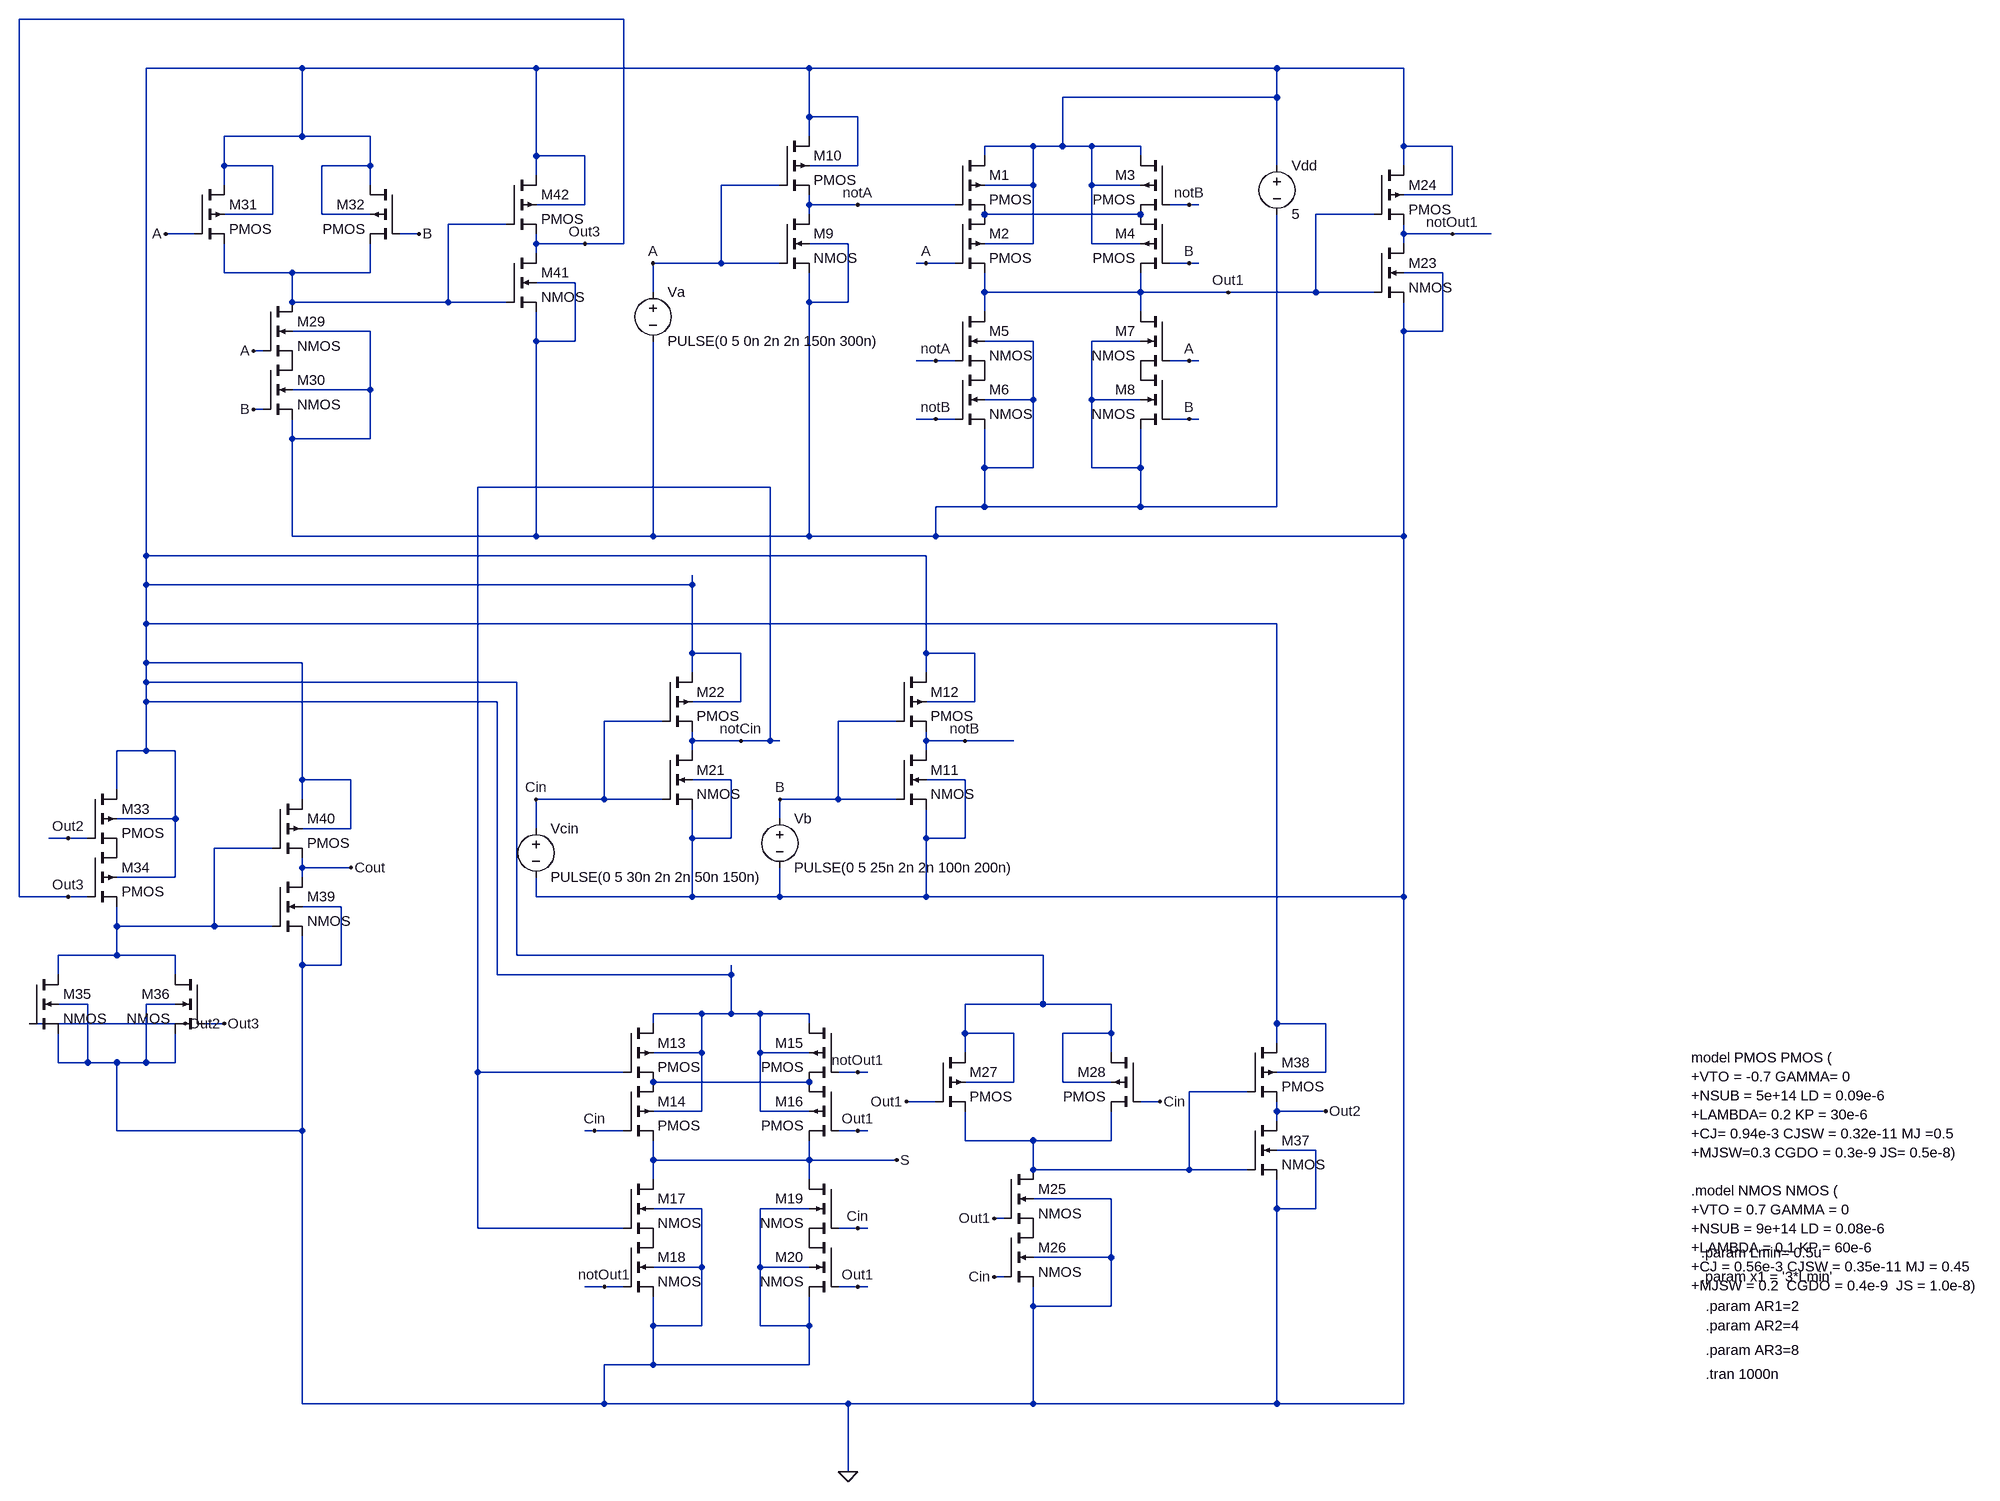
[diagram p0: schematic Full Adder.asc]
Full Adder.asc, the LTspice schematic file:
Version 4
SHEET 1 3220 2340
WIRE -560 -384 -1552 -384
WIRE -1088 -304 -1344 -304
WIRE -704 -304 -1088 -304
WIRE -256 -304 -704 -304
WIRE 512 -304 -256 -304
WIRE 720 -304 512 -304
WIRE 512 -256 512 -304
WIRE 512 -256 160 -256
WIRE -256 -224 -256 -304
WIRE -176 -224 -256 -224
WIRE -1088 -192 -1088 -304
WIRE -1088 -192 -1216 -192
WIRE -976 -192 -1088 -192
WIRE -256 -192 -256 -224
WIRE 112 -176 32 -176
WIRE 160 -176 160 -256
WIRE 160 -176 112 -176
WIRE 208 -176 160 -176
WIRE 288 -176 208 -176
WIRE 720 -176 720 -304
WIRE 800 -176 720 -176
WIRE -704 -160 -704 -304
WIRE -624 -160 -704 -160
WIRE 32 -160 32 -176
WIRE 288 -160 288 -176
WIRE -1216 -144 -1216 -192
WIRE -1136 -144 -1216 -144
WIRE -976 -144 -976 -192
WIRE -976 -144 -1056 -144
WIRE -176 -144 -176 -224
WIRE -176 -144 -256 -144
WIRE 512 -144 512 -256
WIRE 720 -144 720 -176
WIRE -704 -128 -704 -160
WIRE -1216 -112 -1216 -144
WIRE -976 -112 -976 -144
WIRE -304 -112 -400 -112
WIRE 112 -112 112 -176
WIRE 112 -112 32 -112
WIRE 208 -112 208 -176
WIRE 288 -112 208 -112
WIRE 800 -96 800 -176
WIRE 800 -96 720 -96
WIRE -624 -80 -624 -160
WIRE -624 -80 -704 -80
WIRE -256 -80 -256 -96
WIRE -176 -80 -256 -80
WIRE -16 -80 -176 -80
WIRE 368 -80 336 -80
WIRE 384 -80 368 -80
WIRE -1136 -64 -1136 -144
WIRE -1136 -64 -1216 -64
WIRE -1056 -64 -1056 -144
WIRE -976 -64 -1056 -64
WIRE -256 -64 -256 -80
WIRE 288 -64 32 -64
WIRE 672 -64 576 -64
WIRE -752 -48 -848 -48
WIRE -1264 -32 -1312 -32
WIRE -896 -32 -928 -32
WIRE 720 -32 720 -48
WIRE 800 -32 720 -32
WIRE 864 -32 800 -32
WIRE -704 -16 -704 -32
WIRE -624 -16 -704 -16
WIRE -560 -16 -560 -384
WIRE -560 -16 -624 -16
WIRE -192 -16 -256 -16
WIRE 112 -16 112 -112
WIRE 112 -16 32 -16
WIRE 208 -16 208 -112
WIRE 288 -16 208 -16
WIRE 720 -16 720 -32
WIRE -704 0 -704 -16
WIRE -400 16 -400 -112
WIRE -400 16 -512 16
WIRE -304 16 -400 16
WIRE -64 16 -80 16
WIRE -16 16 -64 16
WIRE 368 16 336 16
WIRE 384 16 368 16
WIRE -1216 32 -1216 -16
WIRE -1104 32 -1216 32
WIRE -976 32 -976 -16
WIRE -976 32 -1104 32
WIRE 784 32 720 32
WIRE -640 48 -704 48
WIRE -512 64 -512 16
WIRE 32 64 32 32
WIRE 288 64 288 32
WIRE 288 64 32 64
WIRE 432 64 288 64
WIRE 576 64 576 -64
WIRE 576 64 432 64
WIRE 672 64 576 64
WIRE -1104 80 -1104 32
WIRE -848 80 -848 -48
WIRE -848 80 -1104 80
WIRE -752 80 -848 80
WIRE -256 80 -256 32
WIRE -192 80 -192 -16
WIRE -192 80 -256 80
WIRE 32 96 32 64
WIRE 288 96 288 64
WIRE -976 128 -1104 128
WIRE 720 128 720 80
WIRE 784 128 784 32
WIRE 784 128 720 128
WIRE -704 144 -704 96
WIRE -640 144 -640 48
WIRE -640 144 -704 144
WIRE 112 144 32 144
WIRE 288 144 208 144
WIRE -1152 160 -1168 160
WIRE -48 176 -80 176
WIRE -16 176 -48 176
WIRE 368 176 336 176
WIRE 384 176 368 176
WIRE -976 224 -976 128
WIRE -976 224 -1104 224
WIRE 112 240 112 144
WIRE 112 240 32 240
WIRE 208 240 208 144
WIRE 288 240 208 240
WIRE -1152 256 -1168 256
WIRE -48 272 -80 272
WIRE -16 272 -48 272
WIRE 368 272 336 272
WIRE 384 272 368 272
WIRE -1104 304 -1104 272
WIRE -976 304 -976 224
WIRE -976 304 -1104 304
WIRE 32 352 32 288
WIRE 112 352 112 240
WIRE 112 352 32 352
WIRE 208 352 208 240
WIRE 288 352 288 288
WIRE 288 352 208 352
WIRE -320 384 -800 384
WIRE 32 416 32 352
WIRE 32 416 -48 416
WIRE 288 416 288 352
WIRE 288 416 32 416
WIRE 512 416 512 -64
WIRE 512 416 288 416
WIRE -1104 464 -1104 304
WIRE -704 464 -704 144
WIRE -704 464 -1104 464
WIRE -512 464 -512 144
WIRE -512 464 -704 464
WIRE -256 464 -256 80
WIRE -256 464 -512 464
WIRE -48 464 -48 416
WIRE -48 464 -256 464
WIRE 720 464 720 128
WIRE 720 464 -48 464
WIRE -1344 496 -1344 -304
WIRE -64 496 -1344 496
WIRE -1344 544 -1344 496
WIRE -448 544 -448 528
WIRE -448 544 -1344 544
WIRE -1344 608 -1344 544
WIRE 512 608 -1344 608
WIRE -448 656 -448 544
WIRE -368 656 -448 656
WIRE -64 656 -64 496
WIRE 16 656 -64 656
WIRE -1344 672 -1344 608
WIRE -1088 672 -1344 672
WIRE -448 688 -448 656
WIRE -64 688 -64 656
WIRE -1344 704 -1344 672
WIRE -736 704 -1344 704
WIRE -1344 736 -1344 704
WIRE -768 736 -1344 736
WIRE -368 736 -368 656
WIRE -368 736 -448 736
WIRE 16 736 16 656
WIRE 16 736 -64 736
WIRE -496 768 -592 768
WIRE -112 768 -208 768
WIRE -448 800 -448 784
WIRE -368 800 -448 800
WIRE -320 800 -320 384
WIRE -320 800 -368 800
WIRE -304 800 -320 800
WIRE -64 800 -64 784
WIRE 0 800 -64 800
WIRE 80 800 0 800
WIRE -1344 816 -1344 736
WIRE -1344 816 -1392 816
WIRE -1296 816 -1344 816
WIRE -448 816 -448 800
WIRE -64 816 -64 800
WIRE -1088 864 -1088 672
WIRE -1008 864 -1088 864
WIRE -384 864 -448 864
WIRE 0 864 -64 864
WIRE -1392 880 -1392 816
WIRE -1088 896 -1088 864
WIRE -592 896 -592 768
WIRE -592 896 -704 896
WIRE -496 896 -592 896
WIRE -208 896 -208 768
WIRE -208 896 -304 896
WIRE -112 896 -208 896
WIRE -1296 928 -1296 816
WIRE -1296 928 -1392 928
WIRE -304 928 -304 896
WIRE -1008 944 -1008 864
WIRE -1008 944 -1088 944
WIRE -704 944 -704 896
WIRE -1472 960 -1504 960
WIRE -1440 960 -1472 960
WIRE -448 960 -448 912
WIRE -384 960 -384 864
WIRE -384 960 -448 960
WIRE -64 960 -64 912
WIRE 0 960 0 864
WIRE 0 960 -64 960
WIRE -1136 976 -1232 976
WIRE -1088 1008 -1088 992
WIRE -1008 1008 -1088 1008
WIRE -1296 1024 -1296 928
WIRE -1296 1024 -1392 1024
WIRE -1088 1024 -1088 1008
WIRE -1552 1056 -1552 -384
WIRE -1472 1056 -1552 1056
WIRE -1440 1056 -1472 1056
WIRE -704 1056 -704 1024
WIRE -448 1056 -448 960
WIRE -448 1056 -704 1056
WIRE -304 1056 -304 1008
WIRE -304 1056 -448 1056
WIRE -64 1056 -64 960
WIRE -64 1056 -304 1056
WIRE 720 1056 720 464
WIRE 720 1056 -64 1056
WIRE -1024 1072 -1088 1072
WIRE -1392 1104 -1392 1072
WIRE -1232 1104 -1232 976
WIRE -1232 1104 -1392 1104
WIRE -1136 1104 -1232 1104
WIRE -1392 1152 -1392 1104
WIRE -1392 1152 -1488 1152
WIRE -1296 1152 -1392 1152
WIRE -736 1152 -736 704
WIRE 128 1152 -736 1152
WIRE -1088 1168 -1088 1120
WIRE -1024 1168 -1024 1072
WIRE -1024 1168 -1088 1168
WIRE -1488 1184 -1488 1152
WIRE -1296 1184 -1296 1152
WIRE -768 1184 -768 736
WIRE -384 1184 -384 1168
WIRE -384 1184 -768 1184
WIRE -1440 1232 -1488 1232
WIRE -1296 1232 -1344 1232
WIRE 128 1232 128 1152
WIRE 128 1232 0 1232
WIRE 240 1232 128 1232
WIRE -432 1248 -512 1248
WIRE -384 1248 -384 1184
WIRE -384 1248 -432 1248
WIRE -336 1248 -384 1248
WIRE -256 1248 -336 1248
WIRE -1280 1264 -1536 1264
WIRE -1216 1264 -1248 1264
WIRE -512 1264 -512 1248
WIRE -256 1264 -256 1248
WIRE 512 1264 512 608
WIRE 592 1264 512 1264
WIRE 0 1280 0 1232
WIRE 80 1280 0 1280
WIRE 240 1280 240 1232
WIRE 240 1280 160 1280
WIRE 512 1296 512 1264
WIRE -432 1312 -432 1248
WIRE -432 1312 -512 1312
WIRE -336 1312 -336 1248
WIRE -256 1312 -336 1312
WIRE 0 1312 0 1280
WIRE 240 1312 240 1280
WIRE -1488 1328 -1488 1280
WIRE -1440 1328 -1440 1232
WIRE -1440 1328 -1488 1328
WIRE -1392 1328 -1440 1328
WIRE -1344 1328 -1344 1232
WIRE -1344 1328 -1392 1328
WIRE -1296 1328 -1296 1280
WIRE -1296 1328 -1344 1328
WIRE -800 1344 -800 384
WIRE -560 1344 -800 1344
WIRE -176 1344 -208 1344
WIRE -160 1344 -176 1344
WIRE 592 1344 592 1264
WIRE 592 1344 512 1344
WIRE -256 1360 -512 1360
WIRE 80 1360 80 1280
WIRE 80 1360 0 1360
WIRE 160 1360 160 1280
WIRE 240 1360 160 1360
WIRE 464 1376 368 1376
WIRE -48 1392 -96 1392
WIRE 320 1392 288 1392
WIRE -432 1408 -432 1312
WIRE -432 1408 -512 1408
WIRE -336 1408 -336 1312
WIRE -256 1408 -336 1408
WIRE 512 1408 512 1392
WIRE 592 1408 512 1408
WIRE 512 1424 512 1408
WIRE -1392 1440 -1392 1328
WIRE -1088 1440 -1088 1168
WIRE -1088 1440 -1392 1440
WIRE -608 1440 -624 1440
WIRE -560 1440 -608 1440
WIRE -176 1440 -208 1440
WIRE -160 1440 -176 1440
WIRE 0 1456 0 1408
WIRE 112 1456 0 1456
WIRE 240 1456 240 1408
WIRE 240 1456 112 1456
WIRE 576 1472 512 1472
WIRE -512 1488 -512 1456
WIRE -256 1488 -256 1456
WIRE -256 1488 -512 1488
WIRE -112 1488 -256 1488
WIRE 112 1504 112 1456
WIRE 368 1504 368 1376
WIRE 368 1504 112 1504
WIRE 464 1504 368 1504
WIRE -512 1520 -512 1488
WIRE -256 1520 -256 1488
WIRE 240 1552 112 1552
WIRE -432 1568 -512 1568
WIRE -256 1568 -336 1568
WIRE 512 1568 512 1520
WIRE 576 1568 576 1472
WIRE 576 1568 512 1568
WIRE 64 1584 48 1584
WIRE -800 1600 -800 1344
WIRE -560 1600 -800 1600
WIRE -176 1600 -208 1600
WIRE -160 1600 -176 1600
WIRE 240 1648 240 1552
WIRE 240 1648 112 1648
WIRE -432 1664 -432 1568
WIRE -432 1664 -512 1664
WIRE -336 1664 -336 1568
WIRE -256 1664 -336 1664
WIRE 64 1680 48 1680
WIRE -592 1696 -624 1696
WIRE -560 1696 -592 1696
WIRE -176 1696 -208 1696
WIRE -160 1696 -176 1696
WIRE 112 1728 112 1696
WIRE 240 1728 240 1648
WIRE 240 1728 112 1728
WIRE -512 1760 -512 1712
WIRE -432 1760 -432 1664
WIRE -432 1760 -512 1760
WIRE -336 1760 -336 1664
WIRE -256 1760 -256 1712
WIRE -256 1760 -336 1760
WIRE -512 1824 -512 1760
WIRE -512 1824 -592 1824
WIRE -256 1824 -256 1760
WIRE -256 1824 -512 1824
WIRE -1088 1888 -1088 1440
WIRE -592 1888 -592 1824
WIRE -592 1888 -1088 1888
WIRE -192 1888 -592 1888
WIRE 112 1888 112 1728
WIRE 112 1888 -192 1888
WIRE 512 1888 512 1568
WIRE 512 1888 112 1888
WIRE 720 1888 720 1056
WIRE 720 1888 512 1888
WIRE -192 2000 -192 1888
FLAG 432 64 Out1
FLAG -176 -80 notA
FLAG 0 800 notB
FLAG -512 16 A
FLAG 368 -80 notB
FLAG -304 896 B
FLAG -48 272 notB
FLAG -48 176 notA
FLAG 368 176 A
FLAG 368 272 B
FLAG 368 16 B
FLAG -64 16 A
FLAG -112 1488 S
FLAG -176 1344 notOut1
FLAG -592 1696 notOut1
FLAG -176 1600 Cin
FLAG -176 1696 Out1
FLAG -176 1440 Out1
FLAG -608 1440 Cin
FLAG -368 800 notCin
FLAG -704 896 Cin
FLAG 800 -32 notOut1
FLAG 320 1392 Cin
FLAG 48 1584 Out1
FLAG -96 1392 Out1
FLAG 48 1680 Cin
FLAG -896 -32 B
FLAG -1168 160 A
FLAG -1312 -32 A
FLAG -1168 256 B
FLAG -1472 960 Out2
FLAG -1472 1056 Out3
FLAG -1216 1264 Out3
FLAG -1280 1264 Out2
FLAG 592 1408 Out2
FLAG -1008 1008 Cout
FLAG -624 -16 Out3
FLAG -192 2000 0
SYMBOL pmos4 -16 -160 R0
SYMATTR InstName M1
SYMATTR Value2 l={Lmin} w={AR2*Lmin} ad={x1*AR2*Lmin} as={x1*AR2*Lmin} pd={2*x1 + 2*AR2*Lmin} ps={2*x1 + 2*AR2*Lmin}
SYMBOL pmos4 -16 -64 R0
SYMATTR InstName M2
SYMATTR Value2 l={Lmin} w={AR2*Lmin} ad={x1*AR2*Lmin} as={x1*AR2*Lmin} pd={2*x1 + 2*AR2*Lmin} ps={2*x1 + 2*AR2*Lmin}
SYMBOL pmos4 336 -160 M0
SYMATTR InstName M3
SYMATTR Value2 l={Lmin} w={AR2*Lmin} ad={x1*AR2*Lmin} as={x1*AR2*Lmin} pd={2*x1 + 2*AR2*Lmin} ps={2*x1 + 2*AR2*Lmin}
SYMBOL pmos4 336 -64 M0
SYMATTR InstName M4
SYMATTR Value2 l={Lmin} w={AR2*Lmin} ad={x1*AR2*Lmin} as={x1*AR2*Lmin} pd={2*x1 + 2*AR2*Lmin} ps={2*x1 + 2*AR2*Lmin}
SYMBOL voltage 512 -160 R0
SYMATTR InstName Vdd
SYMATTR Value 5
SYMBOL nmos4 -16 96 R0
SYMATTR InstName M5
SYMATTR Value2 l={Lmin} w={AR1*Lmin} ad={x1*AR1*Lmin} as={x1*AR1*Lmin} pd={2*x1 + 2*AR1*Lmin} ps={2*x1 + 2*AR1*Lmin}
SYMBOL nmos4 -16 192 R0
SYMATTR InstName M6
SYMATTR Value2 l={Lmin} w={AR1*Lmin} ad={x1*AR1*Lmin} as={x1*AR1*Lmin} pd={2*x1 + 2*AR1*Lmin} ps={2*x1 + 2*AR1*Lmin}
SYMBOL nmos4 336 96 M0
SYMATTR InstName M7
SYMATTR Value2 l={Lmin} w={AR1*Lmin} ad={x1*AR1*Lmin} as={x1*AR1*Lmin} pd={2*x1 + 2*AR1*Lmin} ps={2*x1 + 2*AR1*Lmin}
SYMBOL nmos4 336 192 M0
SYMATTR InstName M8
SYMATTR Value2 l={Lmin} w={AR1*Lmin} ad={x1*AR1*Lmin} as={x1*AR1*Lmin} pd={2*x1 + 2*AR1*Lmin} ps={2*x1 + 2*AR1*Lmin}
SYMBOL nmos4 -304 -64 R0
SYMATTR InstName M9
SYMATTR Value2 l={Lmin} w={AR1*Lmin} ad={x1*AR1*Lmin} as={x1*AR1*Lmin} pd={2*x1 + 2*AR1*Lmin} ps={2*x1 + 2*AR1*Lmin}
SYMBOL pmos4 -304 -192 R0
SYMATTR InstName M10
SYMATTR Value2 l={Lmin} w={AR2*Lmin} ad={x1*AR2*Lmin} as={x1*AR2*Lmin} pd={2*x1 + 2*AR2*Lmin} ps={2*x1 + 2*AR2*Lmin}
SYMBOL nmos4 -112 816 R0
SYMATTR InstName M11
SYMATTR Value2 l={Lmin} w={AR1*Lmin} ad={x1*AR1*Lmin} as={x1*AR1*Lmin} pd={2*x1 + 2*AR1*Lmin} ps={2*x1 + 2*AR1*Lmin}
SYMBOL pmos4 -112 688 R0
SYMATTR InstName M12
SYMATTR Value2 l={Lmin} w={AR2*Lmin} ad={x1*AR2*Lmin} as={x1*AR2*Lmin} pd={2*x1 + 2*AR2*Lmin} ps={2*x1 + 2*AR2*Lmin}
SYMBOL voltage -512 48 R0
SYMATTR InstName Va
SYMATTR Value PULSE(0 5 0n 2n 2n 150n 300n)
SYMBOL voltage -304 912 R0
SYMATTR InstName Vb
SYMATTR Value PULSE(0 5 25n 2n 2n 100n 200n)
SYMBOL pmos4 -560 1264 R0
SYMATTR InstName M13
SYMATTR Value2 l={Lmin} w={AR2*Lmin} ad={x1*AR2*Lmin} as={x1*AR2*Lmin} pd={2*x1 + 2*AR2*Lmin} ps={2*x1 + 2*AR2*Lmin}
SYMBOL pmos4 -560 1360 R0
SYMATTR InstName M14
SYMATTR Value2 l={Lmin} w={AR2*Lmin} ad={x1*AR2*Lmin} as={x1*AR2*Lmin} pd={2*x1 + 2*AR2*Lmin} ps={2*x1 + 2*AR2*Lmin}
SYMBOL pmos4 -208 1264 M0
SYMATTR InstName M15
SYMATTR Value2 l={Lmin} w={AR2*Lmin} ad={x1*AR2*Lmin} as={x1*AR2*Lmin} pd={2*x1 + 2*AR2*Lmin} ps={2*x1 + 2*AR2*Lmin}
SYMBOL pmos4 -208 1360 M0
SYMATTR InstName M16
SYMATTR Value2 l={Lmin} w={AR2*Lmin} ad={x1*AR2*Lmin} as={x1*AR2*Lmin} pd={2*x1 + 2*AR2*Lmin} ps={2*x1 + 2*AR2*Lmin}
SYMBOL nmos4 -560 1520 R0
SYMATTR InstName M17
SYMATTR Value2 l={Lmin} w={AR1*Lmin} ad={x1*AR1*Lmin} as={x1*AR1*Lmin} pd={2*x1 + 2*AR1*Lmin} ps={2*x1 + 2*AR1*Lmin}
SYMBOL nmos4 -560 1616 R0
SYMATTR InstName M18
SYMATTR Value2 l={Lmin} w={AR1*Lmin} ad={x1*AR1*Lmin} as={x1*AR1*Lmin} pd={2*x1 + 2*AR1*Lmin} ps={2*x1 + 2*AR1*Lmin}
SYMBOL nmos4 -208 1520 M0
SYMATTR InstName M19
SYMATTR Value2 l={Lmin} w={AR1*Lmin} ad={x1*AR1*Lmin} as={x1*AR1*Lmin} pd={2*x1 + 2*AR1*Lmin} ps={2*x1 + 2*AR1*Lmin}
SYMBOL nmos4 -208 1616 M0
SYMATTR InstName M20
SYMATTR Value2 l={Lmin} w={AR1*Lmin} ad={x1*AR1*Lmin} as={x1*AR1*Lmin} pd={2*x1 + 2*AR1*Lmin} ps={2*x1 + 2*AR1*Lmin}
SYMBOL nmos4 -496 816 R0
SYMATTR InstName M21
SYMATTR Value2 l={Lmin} w={AR1*Lmin} ad={x1*AR1*Lmin} as={x1*AR1*Lmin} pd={2*x1 + 2*AR1*Lmin} ps={2*x1 + 2*AR1*Lmin}
SYMBOL pmos4 -496 688 R0
SYMATTR InstName M22
SYMATTR Value2 l={Lmin} w={AR2*Lmin} ad={x1*AR2*Lmin} as={x1*AR2*Lmin} pd={2*x1 + 2*AR2*Lmin} ps={2*x1 + 2*AR2*Lmin}
SYMBOL voltage -704 928 R0
SYMATTR InstName Vcin
SYMATTR Value PULSE(0 5 30n 2n 2n 50n 150n)
SYMBOL nmos4 672 -16 R0
SYMATTR InstName M23
SYMATTR Value2 l={Lmin} w={AR1*Lmin} ad={x1*AR1*Lmin} as={x1*AR1*Lmin} pd={2*x1 + 2*AR1*Lmin} ps={2*x1 + 2*AR1*Lmin}
SYMBOL pmos4 672 -144 R0
SYMATTR InstName M24
SYMATTR Value2 l={Lmin} w={AR2*Lmin} ad={x1*AR2*Lmin} as={x1*AR2*Lmin} pd={2*x1 + 2*AR2*Lmin} ps={2*x1 + 2*AR2*Lmin}
SYMBOL nmos4 64 1504 R0
SYMATTR InstName M25
SYMATTR Value2 l={Lmin} w={AR2*Lmin} ad={x1*AR2*Lmin} as={x1*AR2*Lmin} pd={2*x1 + 2*AR2*Lmin} ps={2*x1 + 2*AR2*Lmin}
SYMBOL nmos4 64 1600 R0
SYMATTR InstName M26
SYMATTR Value2 l={Lmin} w={AR2*Lmin} ad={x1*AR2*Lmin} as={x1*AR2*Lmin} pd={2*x1 + 2*AR2*Lmin} ps={2*x1 + 2*AR2*Lmin}
SYMBOL pmos4 -48 1312 R0
SYMATTR InstName M27
SYMATTR Value2 l={Lmin} w={AR2*Lmin} ad={x1*AR2*Lmin} as={x1*AR2*Lmin} pd={2*x1 + 2*AR2*Lmin} ps={2*x1 + 2*AR2*Lmin}
SYMBOL pmos4 288 1312 M0
SYMATTR InstName M28
SYMATTR Value2 l={Lmin} w={AR2*Lmin} ad={x1*AR2*Lmin} as={x1*AR2*Lmin} pd={2*x1 + 2*AR2*Lmin} ps={2*x1 + 2*AR2*Lmin}
SYMBOL nmos4 -1152 80 R0
SYMATTR InstName M29
SYMATTR Value2 l={Lmin} w={AR2*Lmin} ad={x1*AR2*Lmin} as={x1*AR2*Lmin} pd={2*x1 + 2*AR2*Lmin} ps={2*x1 + 2*AR2*Lmin}
SYMBOL nmos4 -1152 176 R0
SYMATTR InstName M30
SYMATTR Value2 l={Lmin} w={AR2*Lmin} ad={x1*AR2*Lmin} as={x1*AR2*Lmin} pd={2*x1 + 2*AR2*Lmin} ps={2*x1 + 2*AR2*Lmin}
SYMBOL pmos4 -1264 -112 R0
SYMATTR InstName M31
SYMATTR Value2 l={Lmin} w={AR2*Lmin} ad={x1*AR2*Lmin} as={x1*AR2*Lmin} pd={2*x1 + 2*AR2*Lmin} ps={2*x1 + 2*AR2*Lmin}
SYMBOL pmos4 -928 -112 M0
SYMATTR InstName M32
SYMATTR Value2 l={Lmin} w={AR2*Lmin} ad={x1*AR2*Lmin} as={x1*AR2*Lmin} pd={2*x1 + 2*AR2*Lmin} ps={2*x1 + 2*AR2*Lmin}
SYMBOL pmos4 -1440 880 R0
SYMATTR InstName M33
SYMATTR Value2 l={Lmin} w={AR3*Lmin} ad={x1*AR3*Lmin} as={x1*AR3*Lmin} pd={2*x1 + 2*AR3*Lmin} ps={2*x1 + 2*AR3*Lmin}
SYMBOL pmos4 -1440 976 R0
SYMATTR InstName M34
SYMATTR Value2 l={Lmin} w={AR3*Lmin} ad={x1*AR3*Lmin} as={x1*AR3*Lmin} pd={2*x1 + 2*AR3*Lmin} ps={2*x1 + 2*AR3*Lmin}
SYMBOL nmos4 -1536 1184 R0
SYMATTR InstName M35
SYMATTR Value2 l={Lmin} w={AR1*Lmin} ad={x1*AR1*Lmin} as={x1*AR1*Lmin} pd={2*x1 + 2*AR1*Lmin} ps={2*x1 + 2*AR1*Lmin}
SYMBOL nmos4 -1248 1184 M0
SYMATTR InstName M36
SYMATTR Value2 l={Lmin} w={AR1*Lmin} ad={x1*AR1*Lmin} as={x1*AR1*Lmin} pd={2*x1 + 2*AR1*Lmin} ps={2*x1 + 2*AR1*Lmin}
SYMBOL nmos4 464 1424 R0
SYMATTR InstName M37
SYMATTR Value2 l={Lmin} w={AR1*Lmin} ad={x1*AR1*Lmin} as={x1*AR1*Lmin} pd={2*x1 + 2*AR1*Lmin} ps={2*x1 + 2*AR1*Lmin}
SYMBOL pmos4 464 1296 R0
SYMATTR InstName M38
SYMATTR Value2 l={Lmin} w={AR2*Lmin} ad={x1*AR2*Lmin} as={x1*AR2*Lmin} pd={2*x1 + 2*AR2*Lmin} ps={2*x1 + 2*AR2*Lmin}
SYMBOL nmos4 -1136 1024 R0
SYMATTR InstName M39
SYMATTR Value2 l={Lmin} w={AR1*Lmin} ad={x1*AR1*Lmin} as={x1*AR1*Lmin} pd={2*x1 + 2*AR1*Lmin} ps={2*x1 + 2*AR1*Lmin}
SYMBOL pmos4 -1136 896 R0
SYMATTR InstName M40
SYMATTR Value2 l={Lmin} w={AR2*Lmin} ad={x1*AR2*Lmin} as={x1*AR2*Lmin} pd={2*x1 + 2*AR2*Lmin} ps={2*x1 + 2*AR2*Lmin}
SYMBOL nmos4 -752 0 R0
SYMATTR InstName M41
SYMATTR Value2 l={Lmin} w={AR1*Lmin} ad={x1*AR1*Lmin} as={x1*AR1*Lmin} pd={2*x1 + 2*AR1*Lmin} ps={2*x1 + 2*AR1*Lmin}
SYMBOL pmos4 -752 -128 R0
SYMATTR InstName M42
SYMATTR Value2 l={Lmin} w={AR2*Lmin} ad={x1*AR2*Lmin} as={x1*AR2*Lmin} pd={2*x1 + 2*AR2*Lmin} ps={2*x1 + 2*AR2*Lmin}
TEXT 1192 1320 Left 2 !model PMOS PMOS (\n+VTO = -0.7 GAMMA= 0 \n+NSUB = 5e+14 LD = 0.09e-6 \n+LAMBDA= 0.2 KP = 30e-6\n+CJ= 0.94e-3 CJSW = 0.32e-11 MJ =0.5 \n+MJSW=0.3 CGDO = 0.3e-9 JS= 0.5e-8)\n \n.model NMOS NMOS ( \n+VTO = 0.7 GAMMA = 0 \n+NSUB = 9e+14 LD = 0.08e-6 \n+LAMBDA = 0.1 KP = 60e-6 \n+CJ = 0.56e-3 CJSW = 0.35e-11 MJ = 0.45 \n+MJSW = 0.2  CGDO = 0.4e-9  JS = 1.0e-8)
TEXT 1208 1640 Left 2 !.param Lmin= 0.5u
TEXT 1208 1680 Left 2 !.param x1 = '3*Lmin'
TEXT 1216 1728 Left 2 !.param AR1=2
TEXT 1216 1760 Left 2 !.param AR2=4
TEXT 1216 1840 Left 2 !.tran 1000n
TEXT 1216 1800 Left 2 !.param AR3=8

The netlist it stands for:
* Full Adder.asc
M1 N001 notA N002 N001 PMOS l={Lmin} w={AR2*Lmin} ad={x1*AR2*Lmin} as={x1*AR2*Lmin} pd={2*x1 + 2*AR2*Lmin} ps={2*x1 + 2*AR2*Lmin}
M2 N002 A Out1 N001 PMOS l={Lmin} w={AR2*Lmin} ad={x1*AR2*Lmin} as={x1*AR2*Lmin} pd={2*x1 + 2*AR2*Lmin} ps={2*x1 + 2*AR2*Lmin}
M3 N001 notB N002 N001 PMOS l={Lmin} w={AR2*Lmin} ad={x1*AR2*Lmin} as={x1*AR2*Lmin} pd={2*x1 + 2*AR2*Lmin} ps={2*x1 + 2*AR2*Lmin}
M4 N002 B Out1 N001 PMOS l={Lmin} w={AR2*Lmin} ad={x1*AR2*Lmin} as={x1*AR2*Lmin} pd={2*x1 + 2*AR2*Lmin} ps={2*x1 + 2*AR2*Lmin}
Vdd N001 0 5
M5 Out1 notA P001 0 NMOS l={Lmin} w={AR1*Lmin} ad={x1*AR1*Lmin} as={x1*AR1*Lmin} pd={2*x1 + 2*AR1*Lmin} ps={2*x1 + 2*AR1*Lmin}
M6 P001 notB 0 0 NMOS l={Lmin} w={AR1*Lmin} ad={x1*AR1*Lmin} as={x1*AR1*Lmin} pd={2*x1 + 2*AR1*Lmin} ps={2*x1 + 2*AR1*Lmin}
M7 Out1 A P002 0 NMOS l={Lmin} w={AR1*Lmin} ad={x1*AR1*Lmin} as={x1*AR1*Lmin} pd={2*x1 + 2*AR1*Lmin} ps={2*x1 + 2*AR1*Lmin}
M8 P002 B 0 0 NMOS l={Lmin} w={AR1*Lmin} ad={x1*AR1*Lmin} as={x1*AR1*Lmin} pd={2*x1 + 2*AR1*Lmin} ps={2*x1 + 2*AR1*Lmin}
M9 notA A 0 0 NMOS l={Lmin} w={AR1*Lmin} ad={x1*AR1*Lmin} as={x1*AR1*Lmin} pd={2*x1 + 2*AR1*Lmin} ps={2*x1 + 2*AR1*Lmin}
M10 N001 A notA N001 PMOS l={Lmin} w={AR2*Lmin} ad={x1*AR2*Lmin} as={x1*AR2*Lmin} pd={2*x1 + 2*AR2*Lmin} ps={2*x1 + 2*AR2*Lmin}
M11 notB B 0 0 NMOS l={Lmin} w={AR1*Lmin} ad={x1*AR1*Lmin} as={x1*AR1*Lmin} pd={2*x1 + 2*AR1*Lmin} ps={2*x1 + 2*AR1*Lmin}
M12 N001 B notB N001 PMOS l={Lmin} w={AR2*Lmin} ad={x1*AR2*Lmin} as={x1*AR2*Lmin} pd={2*x1 + 2*AR2*Lmin} ps={2*x1 + 2*AR2*Lmin}
Va A 0 PULSE(0 5 0n 2n 2n 150n 300n)
Vb B 0 PULSE(0 5 25n 2n 2n 100n 200n)
M13 N001 notCin N005 N001 PMOS l={Lmin} w={AR2*Lmin} ad={x1*AR2*Lmin} as={x1*AR2*Lmin} pd={2*x1 + 2*AR2*Lmin} ps={2*x1 + 2*AR2*Lmin}
M14 N005 Cin S N001 PMOS l={Lmin} w={AR2*Lmin} ad={x1*AR2*Lmin} as={x1*AR2*Lmin} pd={2*x1 + 2*AR2*Lmin} ps={2*x1 + 2*AR2*Lmin}
M15 N001 notOut1 N005 N001 PMOS l={Lmin} w={AR2*Lmin} ad={x1*AR2*Lmin} as={x1*AR2*Lmin} pd={2*x1 + 2*AR2*Lmin} ps={2*x1 + 2*AR2*Lmin}
M16 N005 Out1 S N001 PMOS l={Lmin} w={AR2*Lmin} ad={x1*AR2*Lmin} as={x1*AR2*Lmin} pd={2*x1 + 2*AR2*Lmin} ps={2*x1 + 2*AR2*Lmin}
M17 S notCin P003 0 NMOS l={Lmin} w={AR1*Lmin} ad={x1*AR1*Lmin} as={x1*AR1*Lmin} pd={2*x1 + 2*AR1*Lmin} ps={2*x1 + 2*AR1*Lmin}
M18 P003 notOut1 0 0 NMOS l={Lmin} w={AR1*Lmin} ad={x1*AR1*Lmin} as={x1*AR1*Lmin} pd={2*x1 + 2*AR1*Lmin} ps={2*x1 + 2*AR1*Lmin}
M19 S Cin P004 0 NMOS l={Lmin} w={AR1*Lmin} ad={x1*AR1*Lmin} as={x1*AR1*Lmin} pd={2*x1 + 2*AR1*Lmin} ps={2*x1 + 2*AR1*Lmin}
M20 P004 Out1 0 0 NMOS l={Lmin} w={AR1*Lmin} ad={x1*AR1*Lmin} as={x1*AR1*Lmin} pd={2*x1 + 2*AR1*Lmin} ps={2*x1 + 2*AR1*Lmin}
M21 notCin Cin 0 0 NMOS l={Lmin} w={AR1*Lmin} ad={x1*AR1*Lmin} as={x1*AR1*Lmin} pd={2*x1 + 2*AR1*Lmin} ps={2*x1 + 2*AR1*Lmin}
M22 N001 Cin notCin N001 PMOS l={Lmin} w={AR2*Lmin} ad={x1*AR2*Lmin} as={x1*AR2*Lmin} pd={2*x1 + 2*AR2*Lmin} ps={2*x1 + 2*AR2*Lmin}
Vcin Cin 0 PULSE(0 5 30n 2n 2n 50n 150n)
M23 notOut1 Out1 0 0 NMOS l={Lmin} w={AR1*Lmin} ad={x1*AR1*Lmin} as={x1*AR1*Lmin} pd={2*x1 + 2*AR1*Lmin} ps={2*x1 + 2*AR1*Lmin}
M24 N001 Out1 notOut1 N001 PMOS l={Lmin} w={AR2*Lmin} ad={x1*AR2*Lmin} as={x1*AR2*Lmin} pd={2*x1 + 2*AR2*Lmin} ps={2*x1 + 2*AR2*Lmin}
M25 N006 Out1 P005 0 NMOS l={Lmin} w={AR2*Lmin} ad={x1*AR2*Lmin} as={x1*AR2*Lmin} pd={2*x1 + 2*AR2*Lmin} ps={2*x1 + 2*AR2*Lmin}
M26 P005 Cin 0 0 NMOS l={Lmin} w={AR2*Lmin} ad={x1*AR2*Lmin} as={x1*AR2*Lmin} pd={2*x1 + 2*AR2*Lmin} ps={2*x1 + 2*AR2*Lmin}
M27 N001 Out1 N006 N001 PMOS l={Lmin} w={AR2*Lmin} ad={x1*AR2*Lmin} as={x1*AR2*Lmin} pd={2*x1 + 2*AR2*Lmin} ps={2*x1 + 2*AR2*Lmin}
M28 N001 Cin N006 N001 PMOS l={Lmin} w={AR2*Lmin} ad={x1*AR2*Lmin} as={x1*AR2*Lmin} pd={2*x1 + 2*AR2*Lmin} ps={2*x1 + 2*AR2*Lmin}
M29 N003 A P006 0 NMOS l={Lmin} w={AR2*Lmin} ad={x1*AR2*Lmin} as={x1*AR2*Lmin} pd={2*x1 + 2*AR2*Lmin} ps={2*x1 + 2*AR2*Lmin}
M30 P006 B 0 0 NMOS l={Lmin} w={AR2*Lmin} ad={x1*AR2*Lmin} as={x1*AR2*Lmin} pd={2*x1 + 2*AR2*Lmin} ps={2*x1 + 2*AR2*Lmin}
M31 N001 A N003 N001 PMOS l={Lmin} w={AR2*Lmin} ad={x1*AR2*Lmin} as={x1*AR2*Lmin} pd={2*x1 + 2*AR2*Lmin} ps={2*x1 + 2*AR2*Lmin}
M32 N001 B N003 N001 PMOS l={Lmin} w={AR2*Lmin} ad={x1*AR2*Lmin} as={x1*AR2*Lmin} pd={2*x1 + 2*AR2*Lmin} ps={2*x1 + 2*AR2*Lmin}
M33 N001 Out2 P007 N001 PMOS l={Lmin} w={AR3*Lmin} ad={x1*AR3*Lmin} as={x1*AR3*Lmin} pd={2*x1 + 2*AR3*Lmin} ps={2*x1 + 2*AR3*Lmin}
M34 P007 Out3 N004 N001 PMOS l={Lmin} w={AR3*Lmin} ad={x1*AR3*Lmin} as={x1*AR3*Lmin} pd={2*x1 + 2*AR3*Lmin} ps={2*x1 + 2*AR3*Lmin}
M35 N004 Out2 0 0 NMOS l={Lmin} w={AR1*Lmin} ad={x1*AR1*Lmin} as={x1*AR1*Lmin} pd={2*x1 + 2*AR1*Lmin} ps={2*x1 + 2*AR1*Lmin}
M36 N004 Out3 0 0 NMOS l={Lmin} w={AR1*Lmin} ad={x1*AR1*Lmin} as={x1*AR1*Lmin} pd={2*x1 + 2*AR1*Lmin} ps={2*x1 + 2*AR1*Lmin}
M37 Out2 N006 0 0 NMOS l={Lmin} w={AR1*Lmin} ad={x1*AR1*Lmin} as={x1*AR1*Lmin} pd={2*x1 + 2*AR1*Lmin} ps={2*x1 + 2*AR1*Lmin}
M38 N001 N006 Out2 N001 PMOS l={Lmin} w={AR2*Lmin} ad={x1*AR2*Lmin} as={x1*AR2*Lmin} pd={2*x1 + 2*AR2*Lmin} ps={2*x1 + 2*AR2*Lmin}
M39 Cout N004 0 0 NMOS l={Lmin} w={AR1*Lmin} ad={x1*AR1*Lmin} as={x1*AR1*Lmin} pd={2*x1 + 2*AR1*Lmin} ps={2*x1 + 2*AR1*Lmin}
M40 N001 N004 Cout N001 PMOS l={Lmin} w={AR2*Lmin} ad={x1*AR2*Lmin} as={x1*AR2*Lmin} pd={2*x1 + 2*AR2*Lmin} ps={2*x1 + 2*AR2*Lmin}
M41 Out3 N003 0 0 NMOS l={Lmin} w={AR1*Lmin} ad={x1*AR1*Lmin} as={x1*AR1*Lmin} pd={2*x1 + 2*AR1*Lmin} ps={2*x1 + 2*AR1*Lmin}
M42 N001 N003 Out3 N001 PMOS l={Lmin} w={AR2*Lmin} ad={x1*AR2*Lmin} as={x1*AR2*Lmin} pd={2*x1 + 2*AR2*Lmin} ps={2*x1 + 2*AR2*Lmin}
.model NMOS NMOS
.model PMOS PMOS
.lib standard.mos
model PMOS PMOS (
+VTO = -0.7 GAMMA= 0
+NSUB = 5e+14 LD = 0.09e-6
+LAMBDA= 0.2 KP = 30e-6
+CJ= 0.94e-3 CJSW = 0.32e-11 MJ =0.5
+MJSW=0.3 CGDO = 0.3e-9 JS= 0.5e-8)
.model NMOS NMOS (
+VTO = 0.7 GAMMA = 0
+NSUB = 9e+14 LD = 0.08e-6
+LAMBDA = 0.1 KP = 60e-6
+CJ = 0.56e-3 CJSW = 0.35e-11 MJ = 0.45
+MJSW = 0.2  CGDO = 0.4e-9  JS = 1.0e-8)
.param Lmin= 0.5u
.param x1 = '3*Lmin'
.param AR1=2
.param AR2=4
.tran 1000n
.param AR3=8
.backanno
.end